# EAGLE design Segment16 (EAGLE 7.5.0)
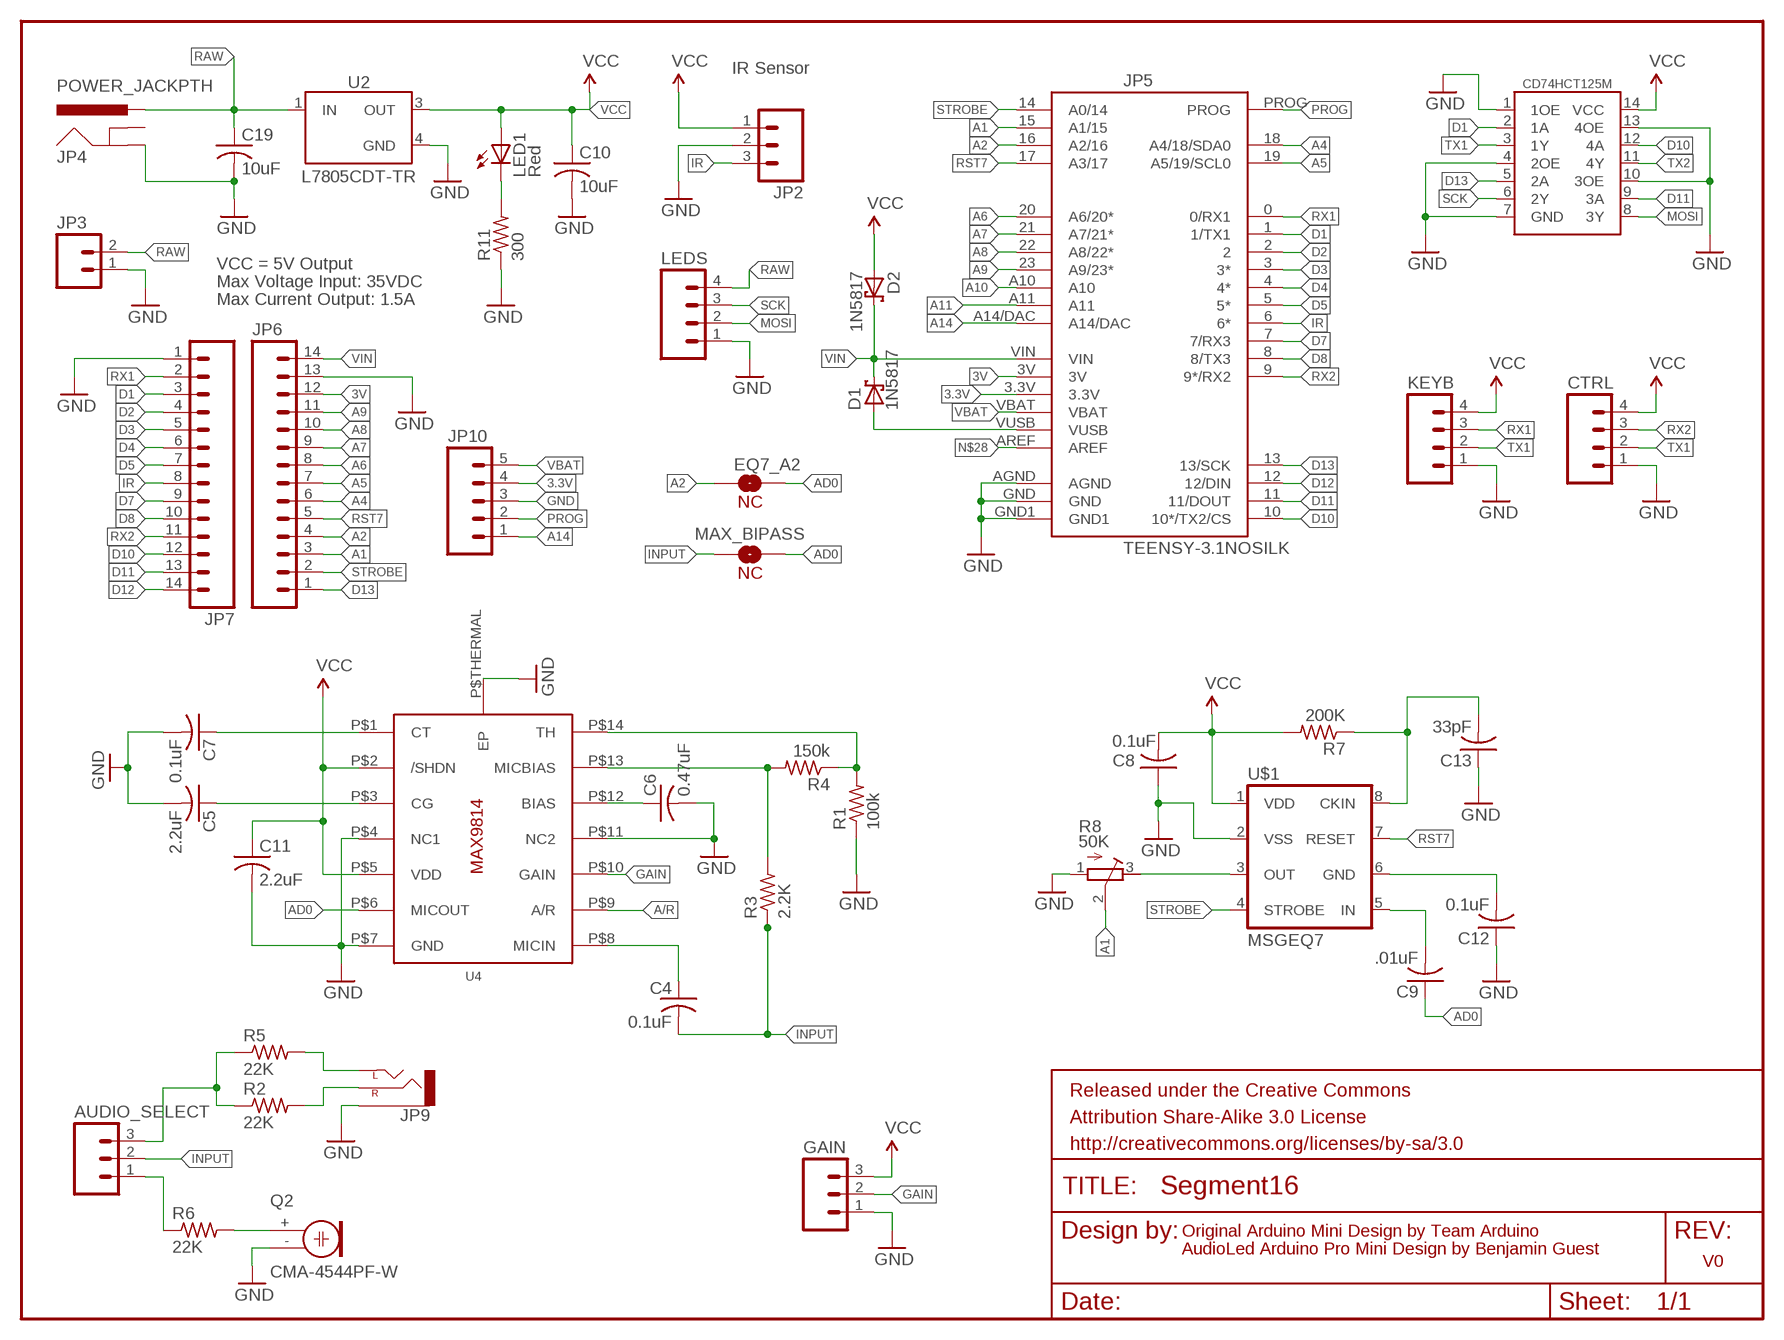
[diagram p0: schematic, sheet 1]

## Parts
AUDIO_SELECT  M03PTH  [1X03]
C4  0.1uF  C-USC0805K  [C0805K]
C5  2.2uF  C-USC0805K  [C0805K]
C6  0.47uF  C-USC0805K  [C0805K]
C7  0.1uF  C-USC0805K  [C0805K]
C8  0.1uF  C-USC0805  [C0805]
C9  .01uF  C-USC0805  [C0805]
C10  10uF  C-USC0805  [C0805]
C11  2.2uF  C-USC0805K  [C0805K]
C12  0.1uF  C-USC0805  [C0805]
C13  33pF  C-USC0805  [C0805]
C19  10uF  C-USC0805  [C0805]
CD74HCT125M  CD74HCT125  [SO14]
CTRL  M04JST-PTH  [JST-4-PTH]
D1  1N5817  1N5817-T  [DO41-7.6]
D2  1N5817  1N5817-T  [DO41-7.6]
EQ7_A2  NC  SOLDERJUMPERNC  [SJ_2S]
FRAME1  FRAME-LETTER  [CREATIVE_COMMONS]
GAIN  M03PTH  [1X03]
JP2  M03JST-PTH  [JST-3-PTH]
JP3  M02JST-PTH-2  [JST-2-PTH]
JP4  POWER_JACKPTH  [POWER_JACK_PTH]
JP5  TEENSY-3.1NOSILK  [TEENSY-3.1_NOSILK]
JP6  M14  [1X14]
JP7  M14  [1X14]
JP9  AUDIO-JACKSMD2  [AUDIO-JACK-3.5MM-SMD]
JP10  M05PTH  [1X05]
KEYB  M04JST-PTH  [JST-4-PTH]
LED1  Red  LEDCHIPLED_0805  [CHIPLED_0805]
LEDS  M04JST-PTH  [JST-4-PTH]
MAX_BIPASS  NC  SOLDERJUMPERNC  [SJ_2S]
Q2  CMA-4544PF-W  ELECTRET  [9.7ELECTRET]
R1  100k  R-US_R0805  [R0805]
R2  22K  R-US_M0805  [M0805]
R3  2.2K  R-US_R0805  [R0805]
R4  150k  R-US_R0805  [R0805]
R5  22K  R-US_M0805  [M0805]
R6  22K  R-US_M0805  [M0805]
R7  200K  R-US_M0805  [M0805]
R8  50K  R-TRIMM3296W  [RTRIM3296W]
R11  300  R-US_M0805  [M0805]
U2  L7805CDT-TR  [DPAK]
U4  MAX9814TDFN14  [TDFN14_3X3MM]
U$1  MSGEQ7  [DIL08-ROUND]

## Nets
3.3V [vcc]: JP5.3.3V JP10.4
3V [vcc]: JP5.3V JP6.12
A1: JP5.15(A1/15) JP6.3 R8.2(S)
A2: EQ7_A2.1 JP5.16(A2/16) JP6.4
A4: JP5.18(A4/18/SDA0) JP6.6
A5: JP5.19(A5/19/SCL0) JP6.7
A6: JP5.20(A6/20*) JP6.8
A7: JP5.21(A7/21*) JP6.9
A8: JP5.22(A8/22*) JP6.10
A9: JP5.23(A9/23*) JP6.11
A10: JP5.A10
A11: JP5.A11
A14: JP5.A14/DAC JP10.1
A/R: U4.P$9(A/R)
AD0: C9.1 EQ7_A2.2 MAX_BIPASS.2 U4.P$6(MICOUT)
D1: CD74HCT125M.2(1A) JP5.1(1/TX1) JP7.3
D2: JP5.2 JP7.4
D3: JP5.3(3*) JP7.5
D4: JP5.4(4*) JP7.6
D5: JP5.5(5*) JP7.7
D7: JP5.7(7/RX3) JP7.9
D8: JP5.8(8/TX3) JP7.10
D10: CD74HCT125M.12(4A) JP5.10(10*/TX2/CS) JP7.12
D11: CD74HCT125M.9(3A) JP5.11(11/DOUT) JP7.13
D12: JP5.12(12/DIN) JP7.14
D13: CD74HCT125M.5(2A) JP5.13(13/SCK) JP6.1
GAIN [mini]: GAIN.2 U4.P$10(GAIN)
GND [vcc]: C5.2 C6.2 C7.2 C8.1 C10.2 C11.2 C12.1 C13.1 C19.2 CD74HCT125M.1(1OE) CD74HCT125M.4(2OE) CD74HCT125M.7(GND) CD74HCT125M.10(3OE) CD74HCT125M.13(4OE) CTRL.1 GAIN.1 JP2.2 JP3.1 JP4.GND JP5.AGND JP5.GND JP5.GND1 JP6.13 JP7.1 JP9.SLEEVE JP10.3 KEYB.1 LEDS.1 Q2.- R1.1 R8.1(A) R11.1 U2.4(GND) U4.P$4(NC1) U4.P$7(GND) U4.P$11(NC2) U4.P$THERMAL(EP) U$1.2(VSS)
INPUT [mini]: AUDIO_SELECT.2 C4.2 MAX_BIPASS.1 R3.1
IR: JP2.3 JP5.6(6*) JP7.8
MOSI: CD74HCT125M.8(3Y) LEDS.2
N$1: Q2.+ R6.2
N$2: JP9.RING(RIGHT) R2.2
N$3: C6.1 U4.P$12(BIAS)
N$4: LED1.C R11.2
N$5: C4.1 U4.P$8(MICIN)
N$6: JP9.TIP(LEFT) R5.2
N$7 [vcc]: D1.A JP5.VUSB
N$8: C7.1 U4.P$1(CT)
N$9: C5.1 U4.P$3(CG)
N$10: R1.2 R4.1 U4.P$14(TH)
N$11: R3.2 R4.2 U4.P$13(MICBIAS)
N$12: C9.2 U$1.5(IN)
N$13: AUDIO_SELECT.3 R2.1 R5.1
N$14: AUDIO_SELECT.1 R6.1
N$15: R8.3(E) U$1.3(OUT)
N$16: C12.2 U$1.6(GND)
N$18: C13.2 R7.1 U$1.8(CKIN)
N$28: JP5.AREF
PROG: JP5.PROG JP10.2
RAW [raw]: C19.1 JP3.2 JP4.PWR LEDS.4 U2.1(IN)
RST7: JP5.17(A3/17) JP6.5 U$1.7(RESET)
RX1: JP5.0(0/RX1) JP7.2 KEYB.3
RX2: CTRL.3 JP5.9(9*/RX2) JP7.11
SCK: CD74HCT125M.6(2Y) LEDS.3
STROBE: JP5.14(A0/14) JP6.2 U$1.4(STROBE)
TX1: CD74HCT125M.3(1Y) CTRL.2 KEYB.2
TX2: CD74HCT125M.11(4Y)
VBAT [vcc]: JP5.VBAT JP10.5
VCC [vcc]: C8.2 C10.1 C11.1 CD74HCT125M.14(VCC) CTRL.4 D2.A GAIN.3 JP2.1 KEYB.4 LED1.A R7.2 U2.3(OUT) U4.P$2(/SHDN) U4.P$5(VDD) U$1.1(VDD)
VIN [vcc]: D1.C D2.C JP5.VIN JP6.14
Unconnected: JP4.GNDBREAK

## Notes on the sheet
- IR Sensor
- VCC = 5V Output
- Max Voltage Input: 35VDC
- Max Current Output: 1.5A
- NC
- NC
- Original Arduino Mini Design by Team Arduino
- AudioLed Arduino Pro Mini Design by Benjamin Guest
- V0

## Library data of the parts
AUDIO_SELECT GAIN = SparkFun-Connectors:M03: Header 3 Standard 3-pin 0.1" header. Use with straight break away headers (SKU : PRT-00116), right angle break away headers (PRT-00553), swiss pins (PRT-00743), machine pins (PRT-00117), and female headers (PRT-00115). Molex polarized connector foot print use with SKU : PRT-08232 with associated crimp pins and housings.
C4-C13 C19 = adafruit:C-US: CAPACITOR, American symbol
CD74HCT125M = bg_eagle_lib:CD74HCT125
CTRL KEYB LEDS = SparkFun-Connectors:M04: Header 4 Standard 4-pin 0.1" header. Use with straight break away headers (SKU : PRT-00116), right angle break away headers (PRT-00553), swiss pins (PRT-00743), machine pins (PRT-00117), and female headers (PRT-00115). Molex polarized connector foot print use with SKU : PRT-08231 with associated crimp pins and housings. 1MM SMD Version SKU: PRT-10208; SKU: PRT-09916
D1 D2 = diode:1N581*: 1.0A SCHOTTKY BARRIER RECTIFIER Source: http://www.diodes.com/datasheets/ds23001.pdf; MF: ON SEMICONDUCTOR; MPN: 1N5817RLG; OC_NEWARK: 93K1999
EQ7_A2 MAX_BIPASS = SparkFun-Passives:SOLDERJUMPER: Solder Jumper Standard SMD solder jumper. Used to automate production. Two varients : Normally Open and Normally Closed are the same, but have different paste layers. NC will have a large amount of paste and should jumper during reflow.
FRAME1 = SparkFun-Aesthetics:FRAME-LETTER: Schematic Frame Standard 8.5x11 US Letter frame
JP2 = SparkFun-Connectors:M03: Header 3 Standard 3-pin 0.1" header. Use with straight break away headers (SKU : PRT-00116), right angle break away headers (PRT-00553), swiss pins (PRT-00743), machine pins (PRT-00117), and female headers (PRT-00115). Molex polarized connector foot print use with SKU : PRT-08232 with associated crimp pins and housings.; SKU: PRT-09915
JP3 = SparkFun-Connectors:M02: Standard 2-pin 0.1" header. Use with - straight break away headers ( PRT-00116) - right angle break away headers (PRT-00553) - swiss pins (PRT-00743) - machine pins (PRT-00117) - female headers (PRT-00115) Molex polarized connector foot print use with: PRT-08233 with associated crimp pins and housings. 2.54_SCREWTERM for use with PRT-10571. 3.5mm Screw Terminal footprints for PRT-08084 5mm Screw Terminal footprints for use with PRT-08432; PROD_ID: CONN-09863; SKU: PRT-09914
JP4 = SparkFun-Connectors:POWER_JACK: Power Jack This is the standard 5.5mm barrel jack for power. The PTH is the most common, proven, reliable, footprint. The Slot footprint only works if the mill layer is transmitted to the PCB fab house so be warned. Mating wall wart : TOL-00298 (and others); PROD_ID: CONN-08197
JP5 = SparkFun-Boards:TEENSY-3.1; OC_NEWARK: unknown; SF_ID: DEV-12646
JP6 JP7 = SparkFun-Connectors:M14: Header 14 Standard 14-pin 0.1" header. Use with straight break away headers (SKU : PRT-00116), right angle break away headers (PRT-00553), swiss pins (PRT-00743), machine pins (PRT-00117), and female headers (PRT-00115).
JP9 = SparkFun-Connectors:AUDIO-JACK: 3.5mm Audio Jack Simple 3.5mm common PCB mount audio jack. Variant PTH is our storefront SKU PRT-08032; PROD_ID: CONN-10353
JP10 = SparkFun-Connectors:M05: Header 5 Standard 5-pin 0.1" header. Use with straight break away headers (SKU : PRT-00116), right angle break away headers (PRT-00553), swiss pins (PRT-00743), machine pins (PRT-00117), and female headers (PRT-00115). Molex polarized connector foot print use with SKU : PRT-08230 with associated crimp pins and housings.
LED1 = adafruit:LED: LED OSRAM: - CHIPLED LG R971, LG N971, LY N971, LG Q971, LY Q971, LO R971, LY R971 LH N974, LH R974 LS Q976, LO Q976, LY Q976 LO Q996 - Hyper CHIPLED LW Q18S LB Q993, LB Q99A, LB R99A - SideLED LS A670, LO A670, LY A670, LG A670, LP A670 LB A673, LV A673, LT A673, LW A673 LH A674 LY A675 LS A676, LA A676, LO A676, LY A676, LW A676 LS A679, LY A679, LG A679 - Hyper Micro SIDELED® LS Y876, LA Y876, LO Y876, LY Y876 LT Y87S - SmartLED LW L88C, LW L88S LB L89C, LB L89S, LG L890 LS L89K, LO L89K, LY L89K LS L896, LA L896, LO L896, LY L896 - TOPLED LS T670, LO T670, LY T670, LG T670, LP T670 LSG T670, LSP T670, LSY T670, LOP T670, LYG T670 LG T671, LOG T671, LSG T671 LB T673, LV T673, LT T673, LW T673 LH T674 LS T676, LA T676, LO T676, LY T676, LB T676, LH T676, LSB T676, LW T676 LB T67C, LV T67C, LT T67C, LS T67K, LO T67K, LY T67K, LW E67C LS E67B, LA E67B, LO E67B, LY E67B, LB E67C, LV E67C, LT E67C LW T67C LS T679, LY T679, LG T679 LS T770, LO T770, LY T770, LG T770, LP T770 LB T773, LV T773, LT T773, LW T773 LH T774 LS E675, LA E675, LY E675, LS T675 LS T776, LA T776, LO T776, LY T776, LB T776 LHGB T686 LT T68C, LB T68C - Hyper Mini TOPLED® LB M676 - Mini TOPLED Santana® LG M470 LS M47K, LO M47K, LY M47K Source: http://www.osram.convergy.de/
Q2 = adafruit:ELECTRET: Electret microphone Thru hole 2.54mm spacing with 9.7mm diameter
R1-R7 R11 = adafruit:R-US_: RESISTOR, American symbol
R8 = rcl:R-TRIMM: Trimm resistor; MF: BOURNS, INC.; MPN: 3296W-1-102LF; OC_NEWARK: 62J1420
U2 = BAG:L7805CDT-TR: Description The L78 series of three-terminal positive regulators is available in TO-220, TO-220FP, D²PAK and DPAK packages and several fixed output voltages, making it useful in a wide range of applications. These regulators can provide local on-card regulation, eliminating the distribution problems associated with single point regulation. Each type embeds internal current limiting, thermal shutdown and safe area protection, making it essentially indestructible. If adequate heat sinking is provided, they can deliver over 1 A output current. Although designed primarily as fixed voltage regulators, these devices can be used with external components to obtain adjustable voltage and currents.
U4 = adafruit:MAX9814
U$1 = bg_eagle_lib:MSGEQ7: The seven band graphic equalizer IC is a CMOS chip that divides the audio spectrum into seven bands, 63Hz, 160Hz, 400Hz, 1kHz, 2.5kHz, 6.25kHz and 16kHz. The seven frequencies are peak detected and multiplexed to the output to provide a DC representation of the amplitude of each band. No external components are needed to select the filter responses. Only an off chip resistor and capacitor are needed to select the on chip clock oscillator frequency. The filter center frequencies track this frequency

## Net classes
0 default: width 0.254 mm, drill 0.381 mm, clearance 0.254 mm
1 raw: width 0.508 mm, drill 0.381 mm, clearance 0.254 mm
2 vcc: width 0.508 mm, drill 0.381 mm, clearance 0.254 mm
3 mini: width 0.203 mm, drill 0.381 mm, clearance 0.203 mm

## Board
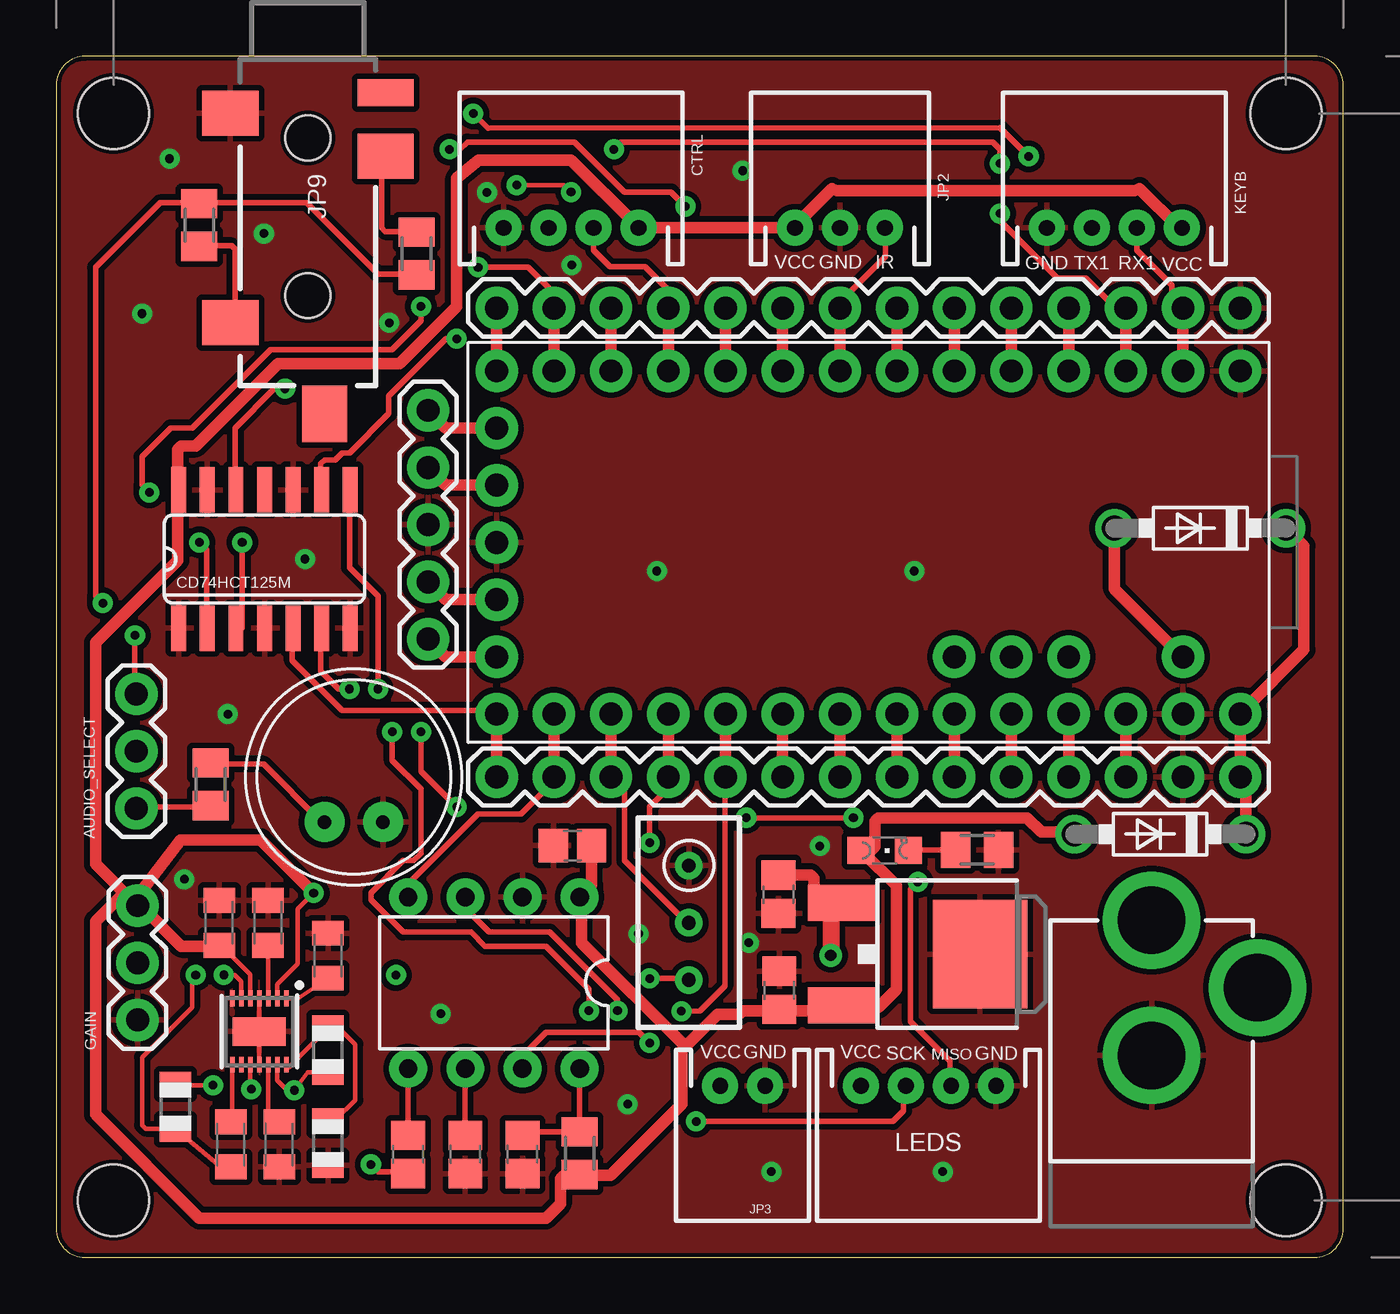
[diagram p1: board, top side]
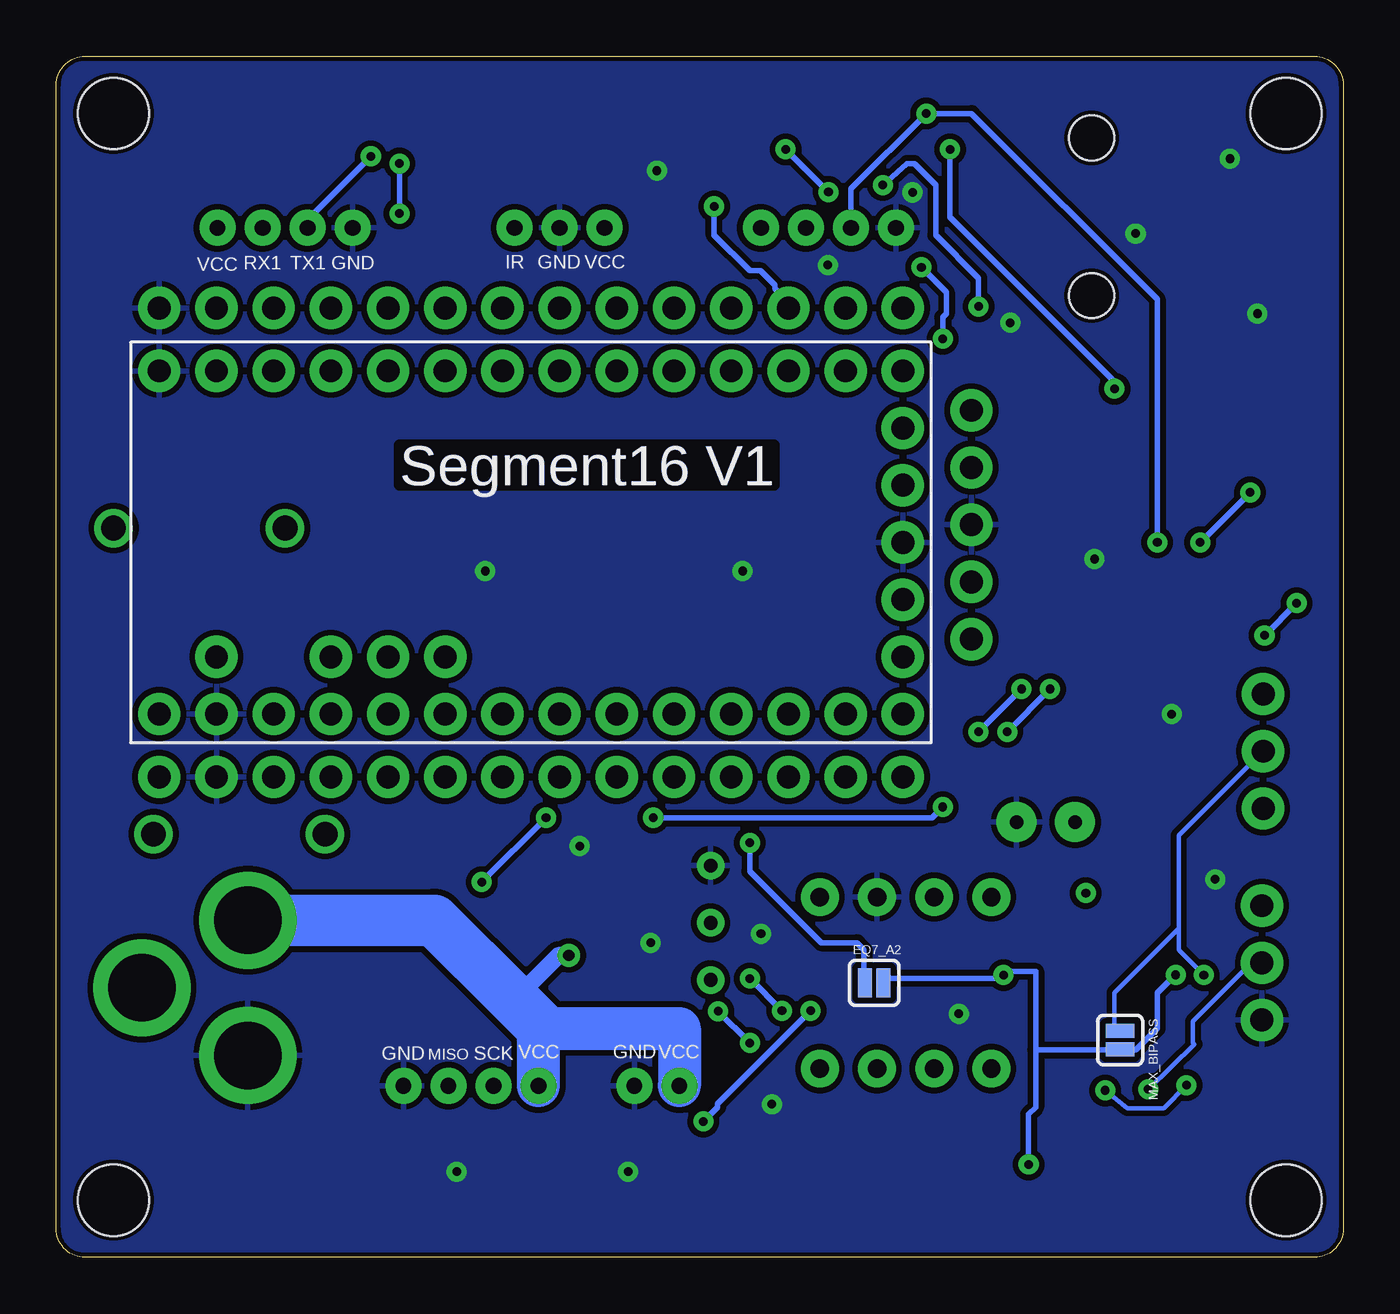
[diagram p2: board, bottom side, seen from below]

Size 57.15 x 53.34 mm. Coordinates in mm from the lower left corner, seen from the top.
Outline: 57.15,1.27 57.15,52.07 arc90 55.88,53.34 1.27,53.34 arc90 0,52.07 0,1.27 arc90 1.27,0 55.88,0 arc90 57.15,1.27
Copper layers (1*16): Top 0.035mm / dielectric 1.5mm / Bottom 0.035mm
Design rules "SparkFun-2-layer *": minimum track width 8mil, minimum drill 15mil, track to track 8mil, track to pad 8mil, pad to pad 8mil, via to via 8mil, smd to smd 8mil, copper to edge 8mil, drill to drill 8mil, minimum pad ring 12mil, minimum via ring 10mil, stop-mask expansion 4mil, vias tented up to drill 20mil, thermal gap 10mil
Holes 3.17 mm at 54.61,2.54 2.54,2.54 2.54,50.8 54.61,50.8

### Footprints (pad centres in the part's own frame; a part is rotated, then mirrored left to right if it is on the bottom)
1X03 = drill 1.016 pad 1.88: 1 0,0; 2 2.54,0; 3 5.08,0
C0805K = smd 1.1 x 1.4: 1 -1,0; 2 1,0
C0805 = smd 1.3 x 1.5: 1 -0.85,0; 2 0.85,0
SO14 = smd 0.66 x 2.032: 1 -3.81,-3.073; 2 -2.54,-3.073; 3 -1.27,-3.073; 4 0,-3.073; 5 1.27,-3.073; 6 2.54,-3.073; 7 3.81,-3.073; 8 3.81,3.073; 9 2.54,3.073; 10 1.27,3.073; 11 0,3.073; 12 -1.27,3.073; 13 -2.54,3.073; 14 -3.81,3.073
JST-4-PTH = drill 0.7 pad 1.6: 1 -3,0; 2 -1,0; 3 1,0; 4 3,0
DO41-7.6 = drill 1.1 pad 1.7: A 3.81,0; C -3.81,0
SJ_2S = smd 0.635 x 1.27: 1 -0.412,0; 2 0.412,0
JST-3-PTH = drill 0.7 pad 1.6: 1 -2,0; 2 0,0; 3 2,0
JST-2-PTH = drill 0.7 pad 1.6: 1 -1,0; 2 1,0
POWER_JACK_PTH = drill 2.997 pad 4.318: GND 0,7.7; GNDBREAK 4.7,10.7; PWR 0,13.7
TEENSY-3.1_NOSILK = drill 1.016 pad 1.88: 0 16.51,3.81; 1 16.51,6.35; 2 16.51,8.89; 3 16.51,11.43; 3.3V 11.43,34.29; 3V 1.27,6.35; 4 16.51,13.97; 5 16.51,16.51; 6 16.51,19.05; 7 16.51,21.59; 8 16.51,24.13; 9 16.51,26.67; 10 16.51,29.21; 11 16.51,31.75; 12 16.51,34.29; 13 1.27,34.29; 14 1.27,31.75; 15 1.27,29.21; 16 1.27,26.67; 17 1.27,24.13; 18 1.27,21.59; 19 1.27,19.05; 20 1.27,16.51; 21 1.27,13.97; 22 1.27,11.43; 23 1.27,8.89; A10 3.81,11.43; A11 3.81,13.97; A14/DAC 3.81,34.29; AGND 1.27,3.81; AREF 3.81,8.89; GND 8.89,34.29; GND1 16.51,1.27; PROG 6.35,34.29; VBAT 13.97,34.29; VIN 1.27,1.27; VUSB 3.81,3.81
1X14 = drill 1.016 pad 1.88: 1 0,0; 2 2.54,0; 3 5.08,0; 4 7.62,0; 5 10.16,0; 6 12.7,0; 7 15.24,0; 8 17.78,0; 9 20.32,0; 10 22.86,0; 11 25.4,0; 12 27.94,0; 13 30.48,0; 14 33.02,0
AUDIO-JACK-3.5MM-SMD = smd 2 x 2.5: RING 4.3,3.45; SLEEVE 2.4,-3.45; TIP 11.7,-3.45 | smd 1.2 x 2.5: RSH 1.5,3.45 | smd 2.5 x 2: TSH 15.75,0.75 | hole 2: 3.5,0; 10.5,0
1X05 = drill 1.016 pad 1.88: 1 0,0; 2 2.54,0; 3 5.08,0; 4 7.62,0; 5 10.16,0
CHIPLED_0805 = smd 1.2 x 1.2: A 0,-1.05; C 0,1.05
9.7ELECTRET = drill 0.6 pad 1.778: + 1.3,2; - -1.3,2
R0805 = smd 1.1 x 1.4: 1 -1,0; 2 1,0
M0805 = smd 1.3 x 1.6: 1 -0.95,0; 2 0.95,0
RTRIM3296W = drill 0.61: 1 0,-2.54; 2 0,0; 3 0,2.54
DPAK = smd 1.6 x 3: 1 -2.28,-4.04; 3 2.28,-4.04 | smd 4.826 x 4.191: 4 0,2.096
TDFN14_3X3MM = smd 0.7 x 0.2: P$1 -1.475,1.2; P$2 -1.475,0.8; P$3 -1.475,0.4; P$4 -1.475,0; P$5 -1.475,-0.4; P$6 -1.475,-0.8; P$7 -1.475,-1.2; P$8 1.475,-1.2; P$9 1.475,-0.8; P$10 1.475,-0.4; P$11 1.475,0; P$12 1.475,0.4; P$13 1.475,0.8; P$14 1.475,1.2 | smd 1.27 x 2.35: P$THERMAL 0,0
DIL08-ROUND = drill 0.813 pad 1.676: 1 -3.81,3.81; 2 -3.81,1.27; 3 -3.81,-1.27; 4 -3.81,-3.81; 5 3.81,-3.81; 6 3.81,-1.27; 7 3.81,1.27; 8 3.81,3.81

### Placement (x,y rotation side)
AUDIO_SELECT  3.56,19.94 90 top
C4  7.75,5.02 270 top
C5  9.4,14.86 90 top
C6  9.91,5.02 270 top
C7  12.06,13.4 90 top
C8  22.92,18.29 0 top
C9  15.62,4.57 90 top
C10  32.11,11.86 90 top
C11  7.24,14.86 90 top
C12  18.16,4.57 90 top
C13  20.7,4.57 90 top
C19  32.07,16.13 270 top
CD74HCT125M  9.25,31.01 0 top
CTRL  22.86,45.72 0 top
D1  50.8,32.38 180 top
D2  49.02,18.8 180 top
EQ7_A2  20.83,12.19 0 bottom
FRAME1  0.53,-8.89 0 top  (outside the outline)
GAIN  3.61,10.54 90 top
JP2  34.8,45.72 0 top
JP3  30.48,7.62 180 top
JP4  48.64,1.27 0 top
JP5  53.85,22.86 90 top
JP6  19.56,21.34 0 top
JP7  52.58,42.16 180 top
JP9  11.18,53.21 270 top
JP10  16.51,27.46 90 top
KEYB  46.99,45.72 0 top
LED1  36.79,18.07 270 top
LEDS  38.73,7.62 180 top
MAX_BIPASS  9.91,9.65 270 bottom
Q2  13.21,21.34 180 top
R1  12.06,5.08 90 top
R2  16,44.58 90 top
R3  5.3,6.69 90 top
R4  12.06,9.21 270 top
R5  6.35,45.85 270 top
R6  6.86,21.01 90 top
R7  23.24,4.62 270 top
R8  28.09,14.86 180 top
R11  40.89,18.1 180 top
U2  38.93,13.46 270 top
U4  9.02,10.03 270 top
U$1  19.43,12.19 270 top

### Tracks (layer width: path | path; a pad name or v marks a point on that pad's centre or on a via)
3.3V
  Top 0.508: JP5.3.3V 17.3,34.29 JP10.4
3V
  Top 0.508: JP5.3V JP6.12
A1
  Top 0.254: R8.2 27.94,14.92 25.24,17.62 25.24,20.64 24.77,21.11 JP6.3
  Top 0.508: JP5.15 JP6.3
A2  (via drill 0.38)
  Top 0.254: v26.35,18.41 26.35,20 26.99,20.64 26.99,21.27 JP6.4
  Top 0.508: JP5.16 JP6.4
  Bottom 0.254: v26.35,18.41 26.35,17.14 23.18,13.97 21.59,13.97 21.27,13.65 21.27,12.38 EQ7_A2.1
A4
  Top 0.508: JP5.18 JP6.6
A5
  Top 0.508: JP5.19 JP6.7
A6
  Top 0.508: JP5.20 JP6.8
A7
  Top 0.508: JP5.21 JP6.9
A8
  Top 0.508: JP5.22 JP6.10
A9
  Top 0.508: JP5.23 JP6.11
A14
  Top 0.508: JP5.A14/DAC 17.3,26.67 JP10.1
AD0  (via drill 0.38)
  Top 0.203: U4.P$6 8.22,12.26 7.92,12.55 v7.44,12.55
  Top 0.254: 15.56,3.65 C9.1 15.56,3.81 14.29,3.81 v13.97,4.13
  Bottom 0.254: EQ7_A2.2 20.32,12.38 15.24,12.38 v15.08,12.54 14.92,12.7 13.65,12.7 13.65,9.21 | v13.97,4.13 13.97,6.35 13.65,6.67 13.65,9.21 | v7.44,12.55 7.62,12.38 8.26,11.75 8.26,10.16 9.21,9.21 9.84,9.21 MAX_BIPASS.2 10.16,9.21 13.65,9.21
D1  (via drill 0.38)
  Top 0.203: v20.45,47.62 22.54,47.62 v22.86,47.31
  Top 0.254: v6.35,31.75 6.67,31.43 6.67,27.94 CD74HCT125M.2 | v4.13,33.97 3.81,34.29 3.81,35.56 5.08,36.83 6.03,36.83 9.53,40.32 14.92,40.32 16.19,41.59 v16.19,42.23 | v24.77,49.21 25.08,49.53 41.59,49.53 41.91,49.21 v41.91,48.58 | v41.91,46.35 41.91,46.04 44.45,43.5 45.72,43.5 47.31,41.91 JP7.3
  Top 0.508: JP5.1 JP7.3
  Bottom 0.254: v4.13,33.97 v6.35,31.75 | v16.19,42.23 16.19,43.5 18.1,45.4 18.1,47.62 19.05,48.58 19.37,48.58 v20.45,47.62 | v24.77,49.21 v22.86,47.31 | v41.91,46.35 v41.91,48.58
D2
  Top 0.508: JP5.2 JP7.4
D3
  Top 0.508: JP5.3 JP7.5
D4
  Top 0.508: JP5.4 JP7.6
D5
  Top 0.508: JP5.5 JP7.7
D7
  Top 0.508: JP5.7 JP7.9
D8
  Top 0.508: JP5.8 JP7.10
D10  (via drill 0.38)
  Top 0.254: v10.16,38.58 9.68,38.58 7.94,36.83 7.94,34.13 CD74HCT125M.12 | v17.46,49.21 17.94,49.21 18.26,49.53 23.02,49.53 25.24,47.31 27.3,47.31 v27.94,46.67
  Top 0.508: JP5.10 JP7.12
  Bottom 0.254: v10.16,38.58 10.16,38.89 17.46,46.2 v17.46,49.21 | v27.94,46.67 27.94,45.4 26.35,43.81 25.88,43.81 25.24,43.18 25.24,43.02 24.77,42.55 24.77,42.23 JP7.12
D11  (via drill 0.38)
  Top 0.254: v17.78,40.8 17.3,40.8 14.76,38.26 14.76,37.47 13.02,35.72 12.7,35.72 12.38,35.4 11.91,35.4 11.75,35.24 11.75,34.13 CD74HCT125M.9 | v18.73,43.97 20.95,43.97 22.07,42.86 22.07,42.39 JP7.13
  Top 0.508: JP5.11 JP7.13
  Bottom 0.254: v17.78,40.8 17.78,41.75 17.62,41.91 17.62,42.86 v18.73,43.97
D12
  Top 0.508: JP7.14 JP5.12
D13
  Top 0.254: CD74HCT125M.5 10.48,27.94 10.48,26.51 12.7,24.29 19.37,24.29 JP5.13
  Top 0.508: JP5.13 JP6.1
GAIN  (via drill 0.38)
  Top 0.203: U4.P$10 8.62,7.58 arc45 v8.66,7.47
  Bottom 0.203: v8.66,7.47 6.61,9.47 6.67,9.53 6.67,10.48 3.81,13.34 GAIN.2
GND  (via drill 0.38)
  Top 0.203: U4.P$4 U4.P$THERMAL U4.P$11
  other vias: 19.13,47.29 22.89,44.07 14.78,41.5 7.62,24.13 17.07,10.82 26.67,30.48 38.1,30.48 39.37,3.81 31.75,3.81 3.81,41.91 11.05,31.01 30.76,13.97 33.91,18.26 25.86,14.38 5.69,16.79 25.37,6.81 9.22,45.47 5.03,48.79 30.48,48.26
  pour Top: -1.27,54.61 -1.27,-1.27 58.42,-1.27 58.42,54.61
  pour Bottom: -1.27,54.61 -1.27,-1.27 58.42,-1.27 58.42,54.61
INPUT  (via drill 0.38)
  Top 0.203: C4.2 7.3,4.02 R3.1 5.24,5.71 3.97,5.71 3.81,5.87 3.81,8.89 6.03,11.11 6.03,12.38 v6.19,12.54
  Bottom 0.203: v6.19,12.54 7.3,13.65 7.3,14.61 | AUDIO_SELECT.2 7.3,18.73 7.3,14.61 | 7.3,14.61 10.16,11.75 10.16,10.16 MAX_BIPASS.1
IR
  Top 0.254: JP7.8 34.8,42.42 36.83,44.45 36.83,45.69 JP2.3
  Top 0.508: JP5.6 JP7.8
MOSI  (via drill 0.38)
  Top 0.254: v14.29,25.24 14.29,29.37 13.02,30.64 13.02,33.97 CD74HCT125M.8 | v16.19,23.34 16.19,21.59 v17.78,20 | v35.4,19.53 v30.64,19.53 | v38.26,16.67 37.94,16.35 37.94,10.48 39.69,8.73 39.69,7.62 LEDS.2
  Bottom 0.254: v16.19,23.34 v14.29,25.24 | v17.78,20 18.26,19.53 v30.64,19.53 | v38.26,16.67 v35.4,19.53
N$1
  Top 0.254: R6.2 6.99,21.91 9.21,21.91 11.75,19.37 Q2.+
N$2
  Top 0.254: R2.2 15.88,45.56 14.61,45.56 14.45,45.72 14.45,48.9 14.61,49.05 JP9.RING
N$3
  Top 0.203: U4.P$12 9.42,6.5 C6.1
N$4
  Top 0.254: R11.2 37.94,18.1 LED1.C
N$5
  Top 0.203: U4.P$8 7.82,6.09 C4.1
N$6
  Top 0.254: R5.2 6.35,44.93 7.78,44.93 7.94,44.77 7.94,41.43 7.78,41.43 JP9.TIP
N$7
  Top 0.508: D1.A 46.99,29.69 50.01,26.67 JP5.VUSB
N$8
  Top 0.203: U4.P$1 10.73,11.51 C7.1
N$9
  Top 0.203: U4.P$3 9.42,14.09 C5.1
N$10
  Top 0.203: U4.P$14 10.35,8.43 R4.1 12.53,10.21 13.27,9.46 13.27,6.99 12.37,6.08 R1.2
N$11  (via drill 0.38)
  Top 0.203: R4.2 11.15,8.21 v10.57,7.42 10.26,7.42 9.82,7.86 U4.P$13 | v6.96,7.64 5.34,7.64 R3.2
  Bottom 0.203: v6.96,7.64 7.98,6.63 9.58,6.63 v10.57,7.42
N$12
  Top 0.254: C9.2 U$1.5
N$13  (via drill 0.38)
  Top 0.254: 6.35,46.83 11.11,46.83 14.29,43.66 15.88,43.66 R2.1 | v3.49,27.62 3.49,25.08 AUDIO_SELECT.3 | v2.06,29.05 1.75,29.37 1.75,43.97 4.6,46.83 6.35,46.83 | 6.35,46.83 R5.1
  Bottom 0.254: v2.06,29.05 v3.49,27.62
N$14
  Top 0.254: R6.1 6.67,20 3.81,20 AUDIO_SELECT.1
N$15  (via drill 0.38)
  Top 0.254: v26.35,12.38 27.94,12.38 R8.3 | v24.92,10.95 24.92,11.43 21.91,14.45 19.21,14.45 18.26,15.4 18.26,15.88 U$1.3
  Bottom 0.254: v24.92,10.95 v26.35,12.38
N$16
  Top 0.254: C12.2 U$1.6
N$18
  Top 0.254: C13.2 20.85,5.57 R7.1 U$1.8
PROG
  Top 0.508: JP5.PROG 17.3,29.21 JP10.2
RAW  (via drill 0.51)
  Top 0.508: C19.1 33.5,16.99 33.66,16.83 33.66,15.88 33.81,15.72 34.45,15.72 U2.1
  Top 0.762: U2.1 34.39,15.25 v34.39,13.41
  Bottom 0.762: v34.39,13.41 34.85,13.41 36.83,11.43
  Bottom 1.905: LEDS.4 35.73,10.16 | 35.56,10.16 29.48,10.16 JP3.2
  Bottom 2.032: 35.73,10.16 35.56,10.16
  Bottom 2.286: JP4.PWR 40.37,14.97 36.83,11.43 35.56,10.16
RST7  (via drill 0.38)
  Top 0.254: v26.35,9.53 25.88,10 21.75,10 20.8,9.05 20.8,8.41 U$1.7 | v27.76,10.93 28.57,10.95 29.69,12.06 29.69,21.11 JP6.5
  Top 0.508: JP5.17 JP6.5
  Bottom 0.254: v27.76,10.93 v26.35,9.53
RX1
  Top 0.254: KEYB.3 47.99,44.72 49.53,43.18 49.53,42.67 JP7.2
  Top 0.508: JP5.0 JP7.2
RX2
  Top 0.254: CTRL.3 23.86,44.72 24.59,43.99 26.14,43.99 27.18,42.95 JP7.11
  Top 0.508: JP5.9 JP7.11
SCK  (via drill 0.38)
  Top 0.254: v13.02,25.24 12.54,25.24 11.75,26.04 11.75,27.94 CD74HCT125M.6 | v14.92,23.34 14.92,22.07 16.19,20.8 16.19,17.94 15.88,17.62 15.4,17.62 13.97,16.19 13.97,15.88 15.4,14.45 18.41,14.45 19.05,13.81 21.75,13.81 23.65,11.91 v23.65,10.95 | v28.42,6.03 37.15,6.03 37.62,6.51 37.62,7.62 LEDS.3
  Bottom 0.254: v14.92,23.34 v13.02,25.24 | v23.65,10.95 27.78,6.83 27.78,6.67 v28.42,6.03
STROBE
  Top 0.254: U$1.4 15.72,16.03 15.72,16.67 18.73,19.68 20.64,19.68 22.07,21.11 JP6.2
  Top 0.508: JP5.14 JP6.2
TX1  (via drill 0.38)
  Top 0.254: v8.26,31.75 8.26,27.94 CD74HCT125M.3 | v43.18,48.9 41.91,50.16 19.18,50.14 v18.52,50.8
  Bottom 0.254: v8.26,31.75 8.26,42.55 16.51,50.8 v18.52,50.8 21.86,47.46 CTRL.2 | v43.18,48.9 45.72,46.35 45.72,45.72 KEYB.2
VBAT
  Top 0.508: JP5.VBAT 17.3,36.83 JP10.5
VCC  (via drill 0.38)
  Top 0.203: U4.P$5 8.62,12.57 7.33,13.86 C11.1 | U4.P$2 9.82,12.13 10.72,13.03 10.72,15.47 v11.43,16.18
  Top 0.508: 23.47,18.54 C8.2 23.77,16.54 U$1.1 23.34,15.88 23.34,13.97 27.94,9.37 | KEYB.4 49.85,45.72 48.1,47.47 47.88,47.37 34.67,47.37 34.45,47.47 32.86,45.88 JP2.1 CTRL.4 25.72,45.88 22.86,48.74 18.75,48.74 17.78,47.92 17.78,42.23 15.24,39.69 9.84,39.69 6.19,36.04 5.56,36.04 5.4,35.88 5.4,34.29 CD74HCT125M.14 5.4,33.97 5.4,30.96 1.75,27.3 1.75,17.46 3.49,15.72 GAIN.3 | C11.1 7.14,13.81 5.56,13.81 3.81,15.56 GAIN.3 | 27.94,9.37 29.37,10.79 30.32,10.79 30.48,10.95 31.91,10.95 C10.1 32.23,10.95 33.66,10.95 33.81,11.11 34.77,11.11 U2.3 34.92,11.11 36.51,11.11 37.31,11.91 37.31,16.51 35.88,17.94 LED1.A 36.04,17.94 36.35,18.26 36.35,19.37 36.51,19.53 43.11,19.53 43.74,18.89 45.09,18.89 D2.A | 27.94,9.37 27.78,9.21 27.78,6.83 24.61,3.65 23.34,3.65 R7.2 23.02,3.65 22.54,3.65 22.38,3.49 22.38,2.38 21.75,1.75 6.35,1.75 1.75,6.35 1.75,14.92 2.86,16.03 GAIN.3 | v11.43,16.18 11.43,16.19 9.08,18.54 5.52,18.54 3.49,15.88 GAIN.3
VIN
  Top 0.508: D2.C 52.83,21.08 JP6.14 JP5.VIN 52.7,24.29 55.4,26.99 55.4,31.59 D1.C

### Text on the board
Bottom: Segment16 V1
tPlace: VCC | GND | IR | GND | TX1 | RX1 | VCC | VCC | GND | VCC | SCK | MISO | GND
bPlace: VCC | GND | IR | GND | TX1 | RX1 | VCC | VCC | GND | VCC | SCK | MISO | GND
bNames: Segment16 V1
tDocu: Original Arduino Mini Design by Team Arduino / Arduino Pro Mini Design by SparkFun Electronics / Revised by Pete Lewis, CiderPress by Benjamin Guest